# Altium project auto-pet-feeder.PrjPcb
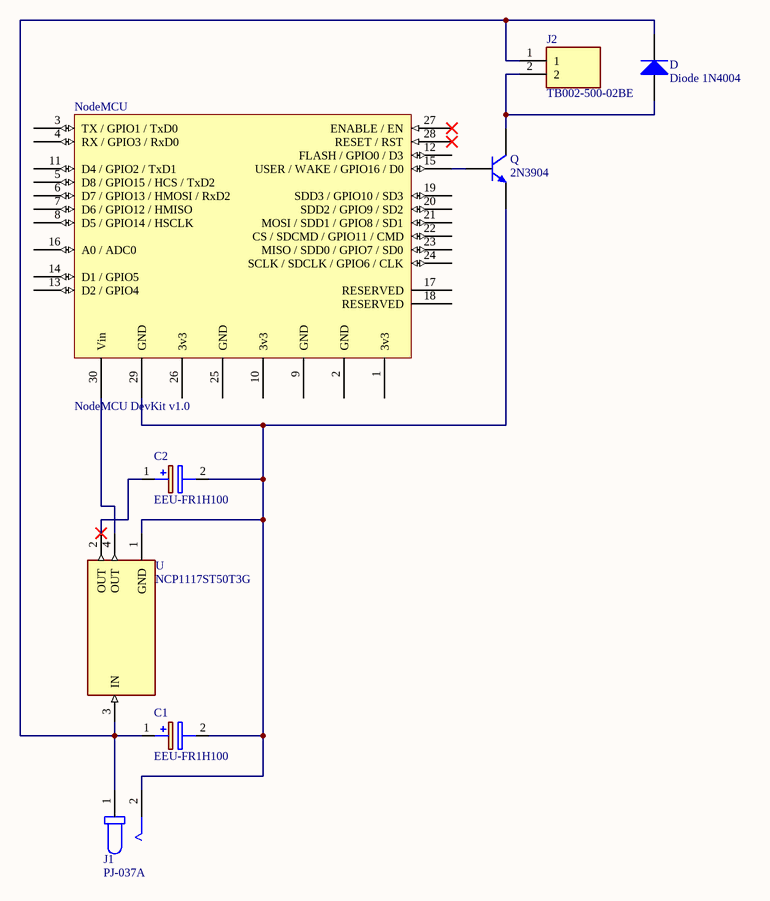
[diagram p0: auto-pet-feeder.SchDoc]
1 sheet, 8 parts. Net scope: global (net labels, ports and power ports of the same name join across sheets).
Board file: auto-pet-feeder.PcbDoc

## Sheet auto-pet-feeder.SchDoc
size A

### Parts
C1  EEU-FR1H100  [CAPPRD200W55D500H1250]
C2  EEU-FR1H100  [CAPPRD200W55D500H1250]
D  Diode 1N4004  [DO-41]
J1  PJ-037A  [CUI_PJ-037A]
J2  TB002-500-02BE  [CUI_TB002-500-02BE]
NodeMCU  NodeMCU DevKit v1.0  [NodeMCU DevKit v1.0 - Inside Labels]
Q  2N3904  [TO-92A]
U  NCP1117ST50T3G  [SOT230P700X180-4N]

### Nets
NetC1_1: C1.1(+) D.2(K) J1.1 J2.1 U.3(IN)
NetC1_2: C1.2(-) C2.2(-) J1.2 NodeMCU.29(GND) Q.1(E) U.1(GND)
NetC2_1: C2.1(+) U.2(OUT)
NetD_1: D.1(A) J2.2 Q.3(C)
NetNodeMCU_15: NodeMCU.15(USER_/_WAKE_/_GPIO16_/_D0) Q.2(B)
NetNodeMCU_30: NodeMCU.30(Vin) U.4(OUT)

Not connected (* = marked no-connect by the designer): NodeMCU 1(3v3) 2(GND) 3(TX_/_GPIO1_/_TxD0) 4(RX_/_GPIO3_/_RxD0) 5(D8_/_GPIO15_/_HCS_/_TxD2) 6(D7_/_GPIO13_/_HMOSI_/_RxD2) 7(D6_/_GPIO12_/_HMISO) 8(D5_/_GPIO14_/_HSCLK) 9(GND) 10(3v3) 11(D4_/_GPIO2_/_TxD1) 12(FLASH_/_GPIO0_/_D3) 13(D2_/_GPIO4) 14(D1_/_GPIO5) 16(A0_/_ADC0) 17(RESERVED) 18(RESERVED) 19(SDD3_/_GPIO10_/_SD3) 20(SDD2_/_GPIO9_/_SD2) 21(MOSI_/_SDD1_/_GPIO8_/_SD1) 22(CS_/_SDCMD_/_GPIO11_/_CMD) 23(MISO_/_SDD0_/_GPIO7_/_SD0) 24(SCLK_/_SDCLK_/_GPIO6_/_CLK) 25(GND) 26(3v3) 27(ENABLE_/_EN)* 28(RESET_/_RST)*

### Library data of the parts
C1 C2 = EEU-FR1H100: Capacitor Polarised; Manufacturer_Name: Panasonic; Datasheet Link: https://mouser.componentsearchengine.com/Datasheets/1/EEU-FR1H100.pdf; Height: 12.5mm; Manufacturer_Part_Number: EEU-FR1H100; Arrow Part Number: EEU-FR1H100; Mouser Part Number: 667-EEU-FR1H100; Mouser Price/Stock: https://www.mouser.co.uk/ProductDetail/Panasonic/EEU-FR1H100?qs=tfZGHB2PWd1NAbdNSgjToQ%3D%3D
D = Diode 1N4004: 1 Amp General Purpose Rectifier; Published: 8-Jun-2000; LatestRevisionDate: 17-Jul-2002; LatestRevisionNote: Re-released for DXP Platform.; DatasheetVersion: 1998; PackageVersion: Aug-1999; PackageReference: DO-41; Publisher: Altium Limited; PackageDescription: Diode, Axial; Body 5.2 x 2.7 mm (LxDia. max), Lead Dia. 0.86 mm (max); Code_JEDEC: DO-204-AL; ComponentLink1Description: Manufacturer Link; ComponentLink1URL: http://www.fairchildsemi.com/; ComponentLink2Description: Datasheet; ComponentLink2URL: http://www.fairchildsemi.com/ds/1N%2F1N4001.pdf
J1 = PJ-037A: 2.0 x 6.5 mm, 2.5 A, Horizontal, Through Hole, Dc Power Jack Connector; MF: CUI Devices; Price: None; Package: None; MP: PJ-037A; Value: *; Availability: Unavailable; SnapEDA_Link: https://www.snapeda.com/parts/PJ-037A/CUI%20Devices/view-part/493699/?ref=snap; CUI_purchase_URL: https://www.cuidevices.com/product/interconnect/connectors/dc-power-connectors/jacks/pj-037a?utm_source=snapeda.com&utm_medium=referral&utm_campaign=snapedaBOM
J2 = TB002-500-02BE: 2~24 Poles, Screw Type, Horizontal, 5.0 Pitch, 22~12 _AWG_, Terminal Block Connector; MF: CUI Devices; SnapEDA_Link: https://www.snapeda.com/parts/TB002-500-02BE/CUI%20Devices/view-part/3590407/?ref=snap; CUI_purchase_URL: https://www.cuidevices.com/product/interconnect/connectors/terminal-blocks/tb002-500-series?utm_source=snapeda.com&utm_medium=referral&utm_campaign=snapedaBOM; MP: TB002-500-02BE; Availability: Unavailable; Price: None; Value: *; Package: None
Q = 2N3904: NPN General Purpose Amplifier; Published: 8-Jun-2000; LatestRevisionDate: 15-Jan-2003; LatestRevisionNote: PCB Footprint 'BCY-W3/D4.7' replaced; DatasheetVersion: 1997; PackageVersion: Sep-1998; PackageReference: TO-92A; Publisher: Altium Limited; PackageDescription: TO, Flat Index; 3 In-Line, Axial Leads; Body Dia. 4.5mm; Leads 0.51 x 0.48 mm (max); ComponentLink1Description: Manufacturer Link; ComponentLink1URL: http://www.fairchildsemi.com/; ComponentLink2Description: Datasheet; ComponentLink2URL: http://www.fairchildsemi.com/ds/2N%2F2N3904.pdf
U = NCP1117ST50T3G: Linear Voltage Regulator IC Positive Fixed 1 Output 1A SOT-223; MF: ON Semiconductor; Package: TO-261-4 ON Semiconductor; MP: NCP1117ST50T3G; Value: *; Availability: Unavailable; SnapEDA_Link: https://www.snapeda.com/parts/NCP1117ST50T3G/ON%20Semiconductor/view-part/104400/?ref=snap; Price: None